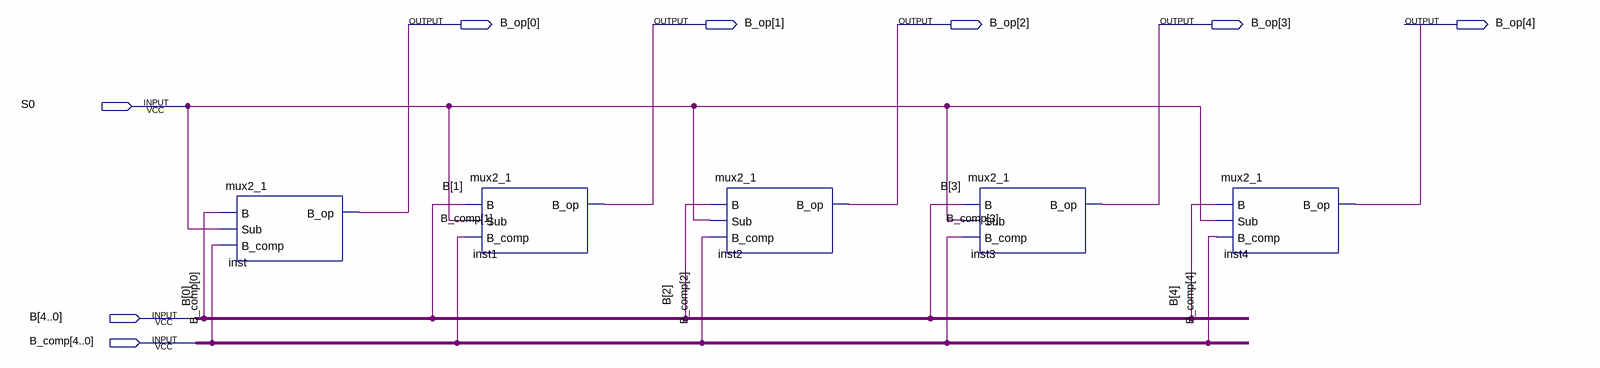
[diagram p0: schematic sheet]
// Quartus schematic MUX2_15BIT.bdf as structural Verilog: 5 symbols, 8 pins
module MUX2_15BIT (
  input  S0,
  input  [4:0] B,
  input  [4:0] B_comp,
  output [4:0] B_op
);

  mux2_1 inst (.B(B[0]), .Sub(S0), .B_comp(B_comp[0]), .B_op(B_op[0]));
  mux2_1 inst1 (.B(B[1]), .Sub(S0), .B_comp(B_comp[1]), .B_op(B_op[1]));
  mux2_1 inst2 (.B(B[2]), .Sub(S0), .B_comp(B_comp[2]), .B_op(B_op[2]));
  mux2_1 inst3 (.B(B[3]), .Sub(S0), .B_comp(B_comp[3]), .B_op(B_op[3]));
  mux2_1 inst4 (.B(B[4]), .Sub(S0), .B_comp(B_comp[4]), .B_op(B_op[4]));
endmodule
